# Altium schematic sheet Sheet1.SchDoc
size A3
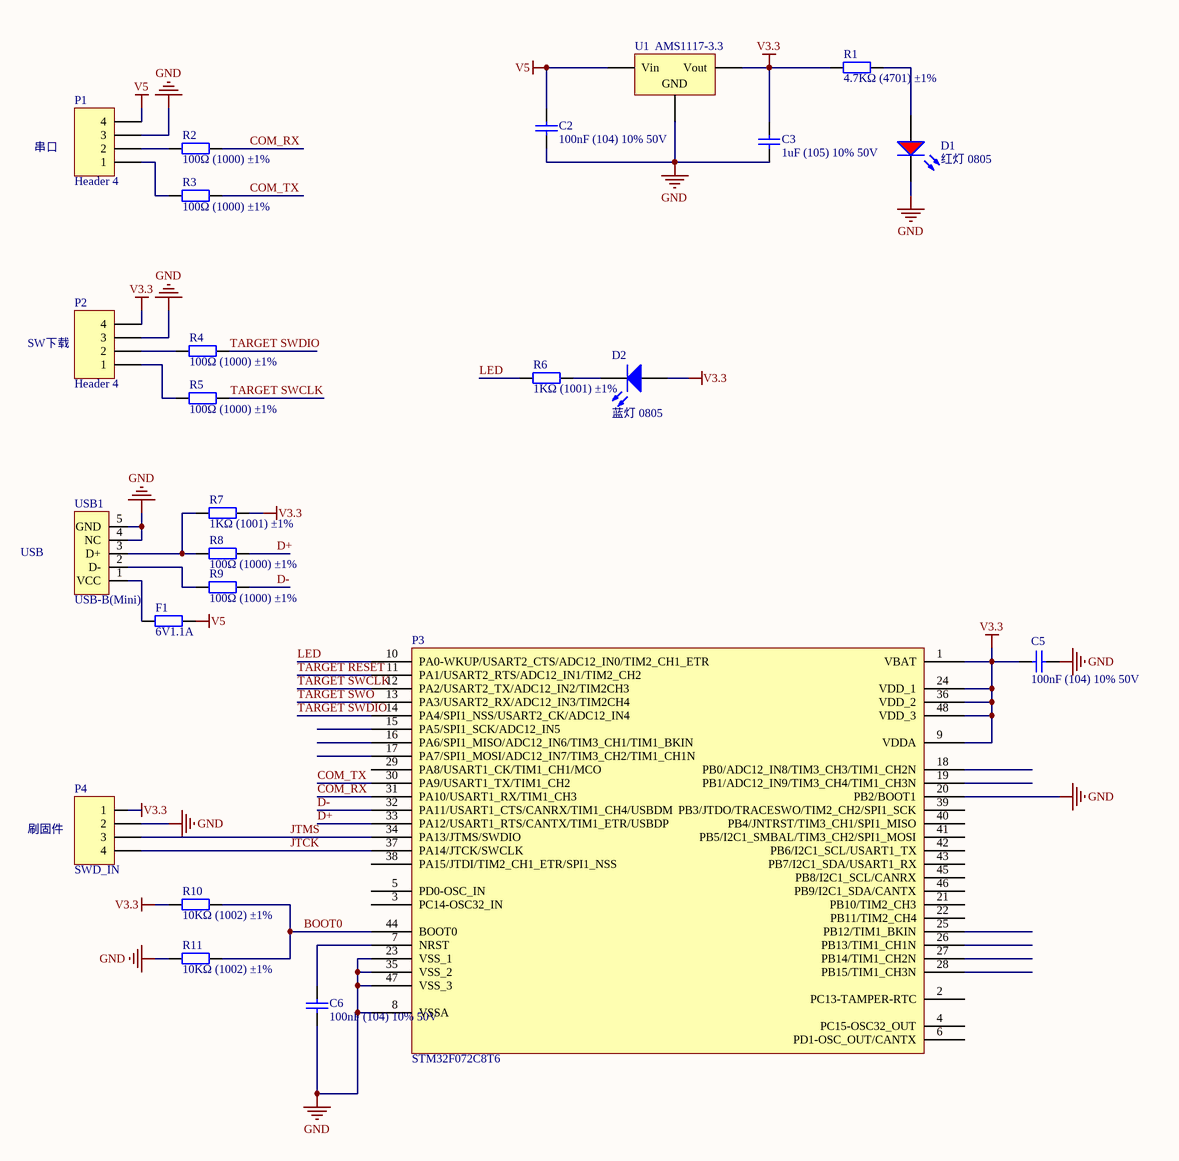
[diagram p0: Sheet1.SchDoc]

## Parts
C2  100nF (104) 10% 50V  [0603_C]
C3  1uF (105) 10% 50V  [0603_C]
C5  100nF (104) 10% 50V  [0603_C]
C6  100nF (104) 10% 50V  [0603_C]
D1  红灯 0805  [0805_LED_S1]
D2  蓝灯 0805  [0805_LED_S1]
F1  6V1.1A  [0603_R]
P1  Header 4  [IDE4_D]
P2  Header 4  [IDE4_D]
P3  STM32F072C8T6  [LQFP48_7X7X05P]
P4  SWD_IN  [HDR1X4]
R1  4.7KΩ (4701) ±1%  [0603_R]
R2  100Ω (1000) ±1%  [0603_R]
R3  100Ω (1000) ±1%  [0603_R]
R4  100Ω (1000) ±1%  [0603_R]
R5  100Ω (1000) ±1%  [0603_R]
R6  1KΩ (1001) ±1%  [0603_R]
R7  1KΩ (1001) ±1%  [0603_R]
R8  100Ω (1000) ±1%  [0603_R]
R9  100Ω (1000) ±1%  [0603_R]
R10  10KΩ (1002) ±1%  [0603_R]
R11  10KΩ (1002) ±1%  [0603_R]
U1  AMS1117-3.3  [SOT-223]
USB1  USB-B(Mini)  [miniUSB]

## Nets
GND: C2.2 C3.2 C5.2 C6.2 D1.K P1.3 P2.3 P3.8(VSSA) P3.20(PB2/BOOT1) P3.23(VSS_1) P3.35(VSS_2) P3.47(VSS_3) P4.2 R11.1 U1.1(GND) USB1.4(NC) USB1.5(GND)
V3.3: C3.1 C5.1 D2.A P2.4 P3.1(VBAT) P3.9(VDDA) P3.24(VDD_1) P3.36(VDD_2) P3.48(VDD_3) P4.1 R1.1 R7.2 R10.1 U1.2(Vout)
V5: C2.1 F1.2 P1.4 U1.3(Vin)
BOOT0: P3.44(BOOT0) R10.2 R11.2
COM_RX: P3.31(PA10/USART1_RX/TIM1_CH3) R2.2
COM_TX: P3.30(PA9/USART1_TX/TIM1_CH2) R3.2
D+: P3.33(PA12/USART1_RTS/CANTX/TIM1_ETR/USBDP) R8.2
D-: P3.32(PA11/USART1_CTS/CANRX/TIM1_CH4/USBDM) R9.2
JTCK: P3.37(PA14/JTCK/SWCLK) P4.4
JTMS: P3.34(PA13/JTMS/SWDIO) P4.3
LED: P3.10(PA0-WKUP/USART2_CTS/ADC12_IN0/TIM2_CH1_ETR) R6.1
TARGET RESET: P3.11(PA1/USART2_RTS/ADC12_IN1/TIM2_CH2)
TARGET SWCLK: P3.12(PA2/USART2_TX/ADC12_IN2/TIM2CH3) R5.2
TARGET SWDIO: P3.14(PA4/SPI1_NSS/USART2_CK/ADC12_IN4) R4.2
TARGET SWO: P3.13(PA3/USART2_RX/ADC12_IN3/TIM2CH4)
NetC6_1: C6.1 P3.7(NRST)
NetD1_A: D1.A R1.2
NetD2_K: D2.K R6.2
NetF1_1: F1.1 USB1.1(VCC)
NetP1_1: P1.1 R3.1
NetP1_2: P1.2 R2.1
NetP2_1: P2.1 R5.1
NetP2_2: P2.2 R4.1
NetR7_1: R7.1 R8.1 USB1.3(D+)
NetR9_1: R9.1 USB1.2(D-)

Not connected (* = marked no-connect by the designer): P3 2(PC13-TAMPER-RTC) 3(PC14-OSC32_IN) 4(PC15-OSC32_OUT) 5(PD0-OSC_IN) 6(PD1-OSC_OUT/CANTX) 15(PA5/SPI1_SCK/ADC12_IN5) 16(PA6/SPI1_MISO/ADC12_IN6/TIM3_CH1/TIM1_BKIN) 17(PA7/SPI1_MOSI/ADC12_IN7/TIM3_CH2/TIM1_CH1N) 18(PB0/ADC12_IN8/TIM3_CH3/TIM1_CH2N) 19(PB1/ADC12_IN9/TIM3_CH4/TIM1_CH3N) 21(PB10/TIM2_CH3) 22(PB11/TIM2_CH4) 25(PB12/TIM1_BKIN) 26(PB13/TIM1_CH1N) 27(PB14/TIM1_CH2N) 28(PB15/TIM1_CH3N) 29(PA8/USART1_CK/TIM1_CH1/MCO) 38(PA15/JTDI/TIM2_CH1_ETR/SPI1_NSS) 39(PB3/JTDO/TRACESWO/TIM2_CH2/SPI1_SCK) 40(PB4/JNTRST/TIM3_CH1/SPI1_MISO) 41(PB5/I2C1_SMBAL/TIM3_CH2/SPI1_MOSI) 42(PB6/I2C1_SCL/USART1_TX) 43(PB7/I2C1_SDA/USART1_RX) 45(PB8/I2C1_SCL/CANRX) 46(PB9/I2C1_SDA/CANTX)

## Notes on the sheet
- 串口
- SW下载
- USB
- 刷固件

## Library data of the parts
C2 C5 C6 = 0603 100nF (104) 10% 50V: 贴片电容; ComponentLink1Description: 供应商链接; ComponentLink1URL: http://www.szlcsc.com/product/details_15331.html; Package: 0603; Supplier: LC; SuppliersPartNumber: C14663
C3 = 0603 1uF (105) 10% 50V: 贴片电容; ComponentLink1Description: 供应商链接; ComponentLink1URL: http://www.szlcsc.com/product/details_16531.html; Package: 0603; Supplier: LC; SuppliersPartNumber: C15849
D1 = 0805 红灯: 发光二极管; ComponentLink1Description: 供应商链接; ComponentLink1URL: http://www.szlcsc.com/product/details_2668.html; Package: 0805; Supplier: LC; SuppliersPartNumber: C2295
D2 = 0805 蓝灯: 发光二极管; ComponentLink1Description: 供应商链接; ComponentLink1URL: http://www.szlcsc.com/product/details_2666.html; Package: 0805; Supplier: LC; SuppliersPartNumber: C2293
F1 = 0603 0Ω (0R0) 1%: 贴片电阻; ComponentLink1Description: 供应商链接; ComponentLink1URL: http://www.szlcsc.com/product/details_21903.html; Package: 0603; Supplier: LC; SuppliersPartNumber: C21189
P1 P2 P4 = Header 4: Header, 4-Pin; LatestRevisionDate: 17-Jul-2002; LatestRevisionNote: Re-released for DXP Platform.; Publisher: Altium Limited
P3 = stm32f103v8t6
R1 = 0603 4.7KΩ (4701) 1%: 贴片电阻; ComponentLink1Description: 供应商链接; ComponentLink1URL: http://www.szlcsc.com/product/details_23889.html; Package: 0603; Supplier: LC; SuppliersPartNumber: C23162
R2-R5 R8 R9 = 0603 100Ω (1000) 1%: 贴片电阻; ComponentLink1Description: 供应商链接; ComponentLink1URL: http://www.szlcsc.com/product/details_23502.html; Package: 0603; Supplier: LC; SuppliersPartNumber: C22775
R6 R7 = 0603 1KΩ (1001) 1%: 贴片电阻; ComponentLink1Description: 供应商链接; ComponentLink1URL: http://www.szlcsc.com/product/details_21904.html; Package: 0603; Supplier: LC; SuppliersPartNumber: C21190
R10 R11 = 0603 10KΩ (1002) 1%: 贴片电阻; ComponentLink1Description: 供应商链接; ComponentLink1URL: http://www.szlcsc.com/product/details_26547.html; Package: 0603; Supplier: LC; SuppliersPartNumber: C25804
U1 = SOT-223 AMS1117-3.3: 低压差线性稳压(LDO); ComponentLink1Description: 供应商链接; ComponentLink1URL: http://www.szlcsc.com/product/details_6652.html; Package: SOT-223; Supplier: LC; SuppliersPartNumber: C6186
USB1 = miniUSB